# Altium schematic sheet 01_fullydiff_config.SchDoc
size A3
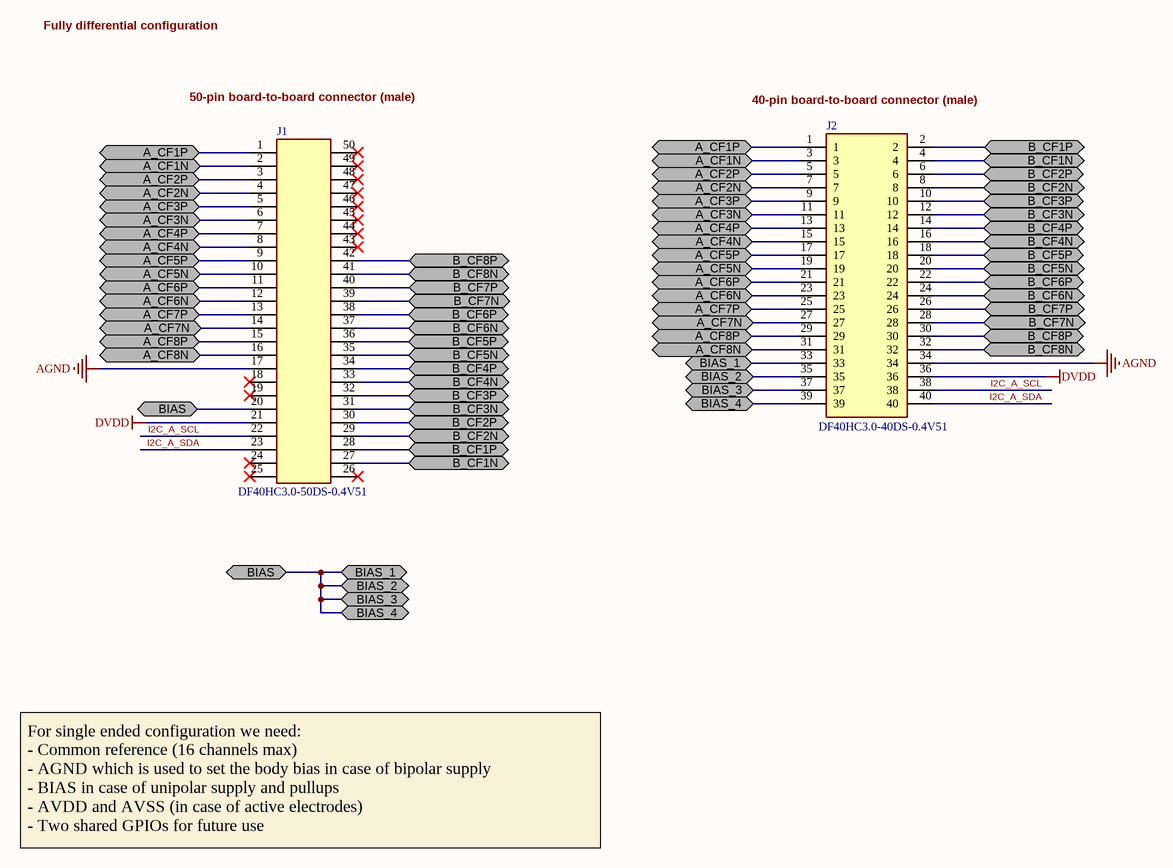
[diagram p0: 01_fullydiff_config.SchDoc]

## Parts
J1  DF40HC3.0-50DS-0.4V51  [CONN_DF40HC3.0-50DS-0.4V51_HIR]
J2  DF40HC3.0-40DS-0.4V51  [CONN40_DF40HC-40DS_HIR]

## Ports
A_CF1N (bidir), A_CF1P (bidir), A_CF2N (bidir), A_CF2P (bidir), A_CF3N (bidir), A_CF3P (bidir), A_CF4N (bidir), A_CF4P (bidir), A_CF5N (bidir), A_CF5P (bidir), A_CF6N (bidir), A_CF6P (bidir), A_CF7N (bidir), A_CF7P (bidir), A_CF8N (bidir), A_CF8P (bidir), B_CF1N (bidir), B_CF1P (bidir), B_CF2N (bidir), B_CF2P (bidir), B_CF3N (bidir), B_CF3P (bidir), B_CF4N (bidir), B_CF4P (bidir), B_CF5N (bidir), B_CF5P (bidir), B_CF6N (bidir), B_CF6P (bidir), B_CF7N (bidir), B_CF7P (bidir), B_CF8N (bidir), B_CF8P (bidir), BIAS (bidir), BIAS_1 (bidir), BIAS_2 (bidir), BIAS_3 (bidir), BIAS_4 (bidir)

## Nets
AGND: J1.17 J2.34
DVDD: J1.21 J2.36
A_CF1N: J1.2 J2.3 ; port A_CF1N
A_CF1P: J1.1 J2.1 ; port A_CF1P
A_CF2N: J1.4 J2.7 ; port A_CF2N
A_CF2P: J1.3 J2.5 ; port A_CF2P
A_CF3N: J1.6 J2.11 ; port A_CF3N
A_CF3P: J1.5 J2.9 ; port A_CF3P
A_CF4N: J1.8 J2.15 ; port A_CF4N
A_CF4P: J1.7 J2.13 ; port A_CF4P
A_CF5N: J1.10 J2.19 ; port A_CF5N
A_CF5P: J1.9 J2.17 ; port A_CF5P
A_CF6N: J1.12 J2.23 ; port A_CF6N
A_CF6P: J1.11 J2.21 ; port A_CF6P
A_CF7N: J1.14 J2.27 ; port A_CF7N
A_CF7P: J1.13 J2.25 ; port A_CF7P
A_CF8N: J1.16 J2.31 ; port A_CF8N
A_CF8P: J1.15 J2.29 ; port A_CF8P
B_CF1N: J1.27 J2.4 ; port B_CF1N
B_CF1P: J1.28 J2.2 ; port B_CF1P
B_CF2N: J1.29 J2.8 ; port B_CF2N
B_CF2P: J1.30 J2.6 ; port B_CF2P
B_CF3N: J1.31 J2.12 ; port B_CF3N
B_CF3P: J1.32 J2.10 ; port B_CF3P
B_CF4N: J1.33 J2.16 ; port B_CF4N
B_CF4P: J1.34 J2.14 ; port B_CF4P
B_CF5N: J1.35 J2.20 ; port B_CF5N
B_CF5P: J1.36 J2.18 ; port B_CF5P
B_CF6N: J1.37 J2.24 ; port B_CF6N
B_CF6P: J1.38 J2.22 ; port B_CF6P
B_CF7N: J1.39 J2.28 ; port B_CF7N
B_CF7P: J1.40 J2.26 ; port B_CF7P
B_CF8N: J1.41 J2.32 ; port B_CF8N
B_CF8P: J1.42 J2.30 ; port B_CF8P
BIAS: J1.20 J2.33 J2.35 J2.37 J2.39 ; port BIAS, port BIAS_1, port BIAS_2, port BIAS_3, port BIAS_4
I2C_A_SCL: J1.22 J2.38
I2C_A_SDA: J1.23 J2.40

Not connected (* = marked no-connect by the designer): J1 18* 19* 24* 25* 26* 43* 44* 45* 46* 47* 48* 49* 50*

## Notes on the sheet
- Fully differential configuration
- (near J1) 50-pin board-to-board connector (male)
- (near J2) 40-pin board-to-board connector (male)
- For single ended configuration we need:
  - Common reference (16 channels max)
  - AGND which is used to set the body bias in case of bipolar supply
  - BIAS in case of unipolar supply and pullups
  - AVDD and AVSS (in case of active electrodes)
  - Two shared GPIOs for future use
- 1
- 2
- 3
- 4
- 5
- 6
- 7
- 8
- A
- B
- C
- D
- Project:
- Date:
- Drawing number:
- Rev:
- Format:
- A3
- Drawn by:
- Laboratory:
- Page
- Sheet:
- of
- File:

## Library data of the parts
J1 = DF40HC3.0-50DS-0.4V51: No Description Available; Mfr_Name: Hirose; RefDes: RefDes; Type: Type
J2 = DF40HC3.0-40DS-0.4V51: No Description Available; Mfr_Name: Hirose; Type: Arrays, Edge Type, Mezzanine (Board to Board); RefDes: RefDes